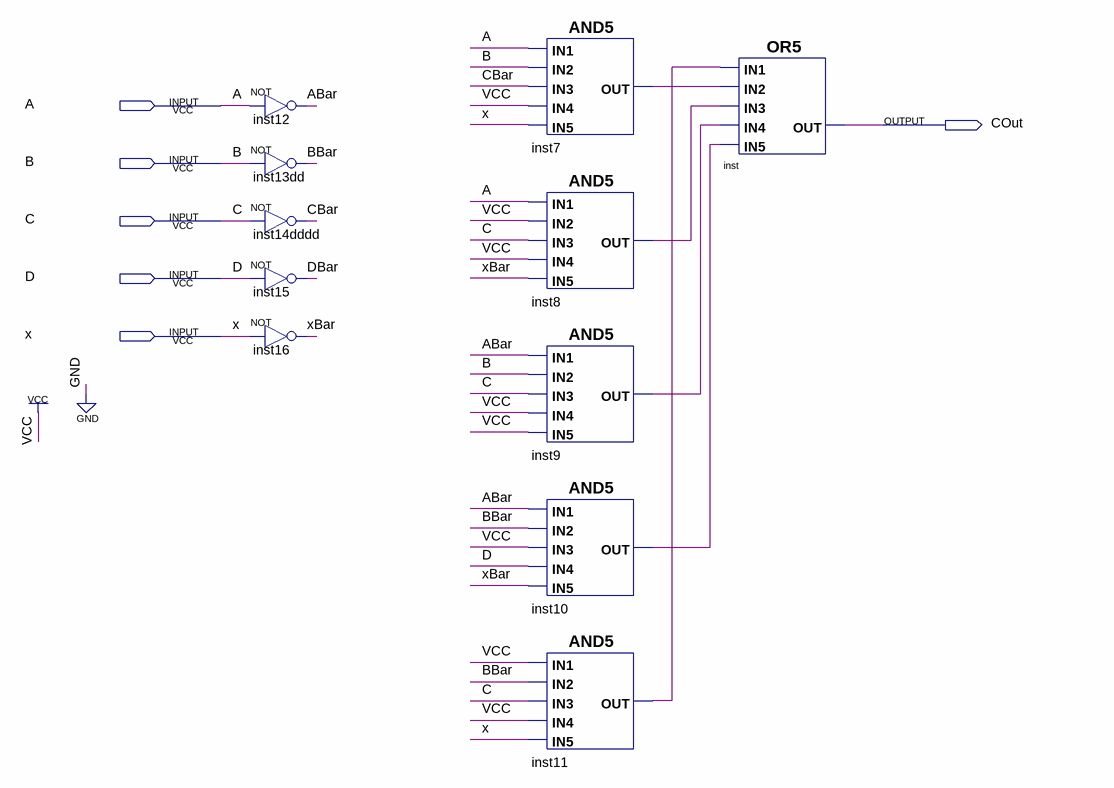
[diagram p0: schematic sheet]
// Quartus schematic COut.bdf as structural Verilog: 11 symbols, 6 pins
module COut (
  input  A,
  input  B,
  input  C,
  input  D,
  input  x,
  output COut
);

  wire ABar, BBar, CBar, DBar, inst7_out, inst8_out, inst9_out, inst10_out, inst11_out, xBar;

  not inst12 (ABar, A);
  not inst13dd (BBar, B);
  not inst14dddd (CBar, C);
  not inst15 (DBar, D);
  not inst16 (xBar, x);
  and inst7 (inst7_out, A, B, CBar, 1'b1, x);
  and inst8 (inst8_out, A, 1'b1, C, 1'b1, xBar);
  and inst9 (inst9_out, ABar, B, C, 1'b1, 1'b1);
  and inst10 (inst10_out, ABar, BBar, 1'b1, D, xBar);
  and inst11 (inst11_out, 1'b1, BBar, C, 1'b1, x);
  or inst (COut, inst11_out, inst7_out, inst8_out, inst9_out, inst10_out);
endmodule
